# EAGLE board HSI-interface-1 (EAGLE 7.6.0)
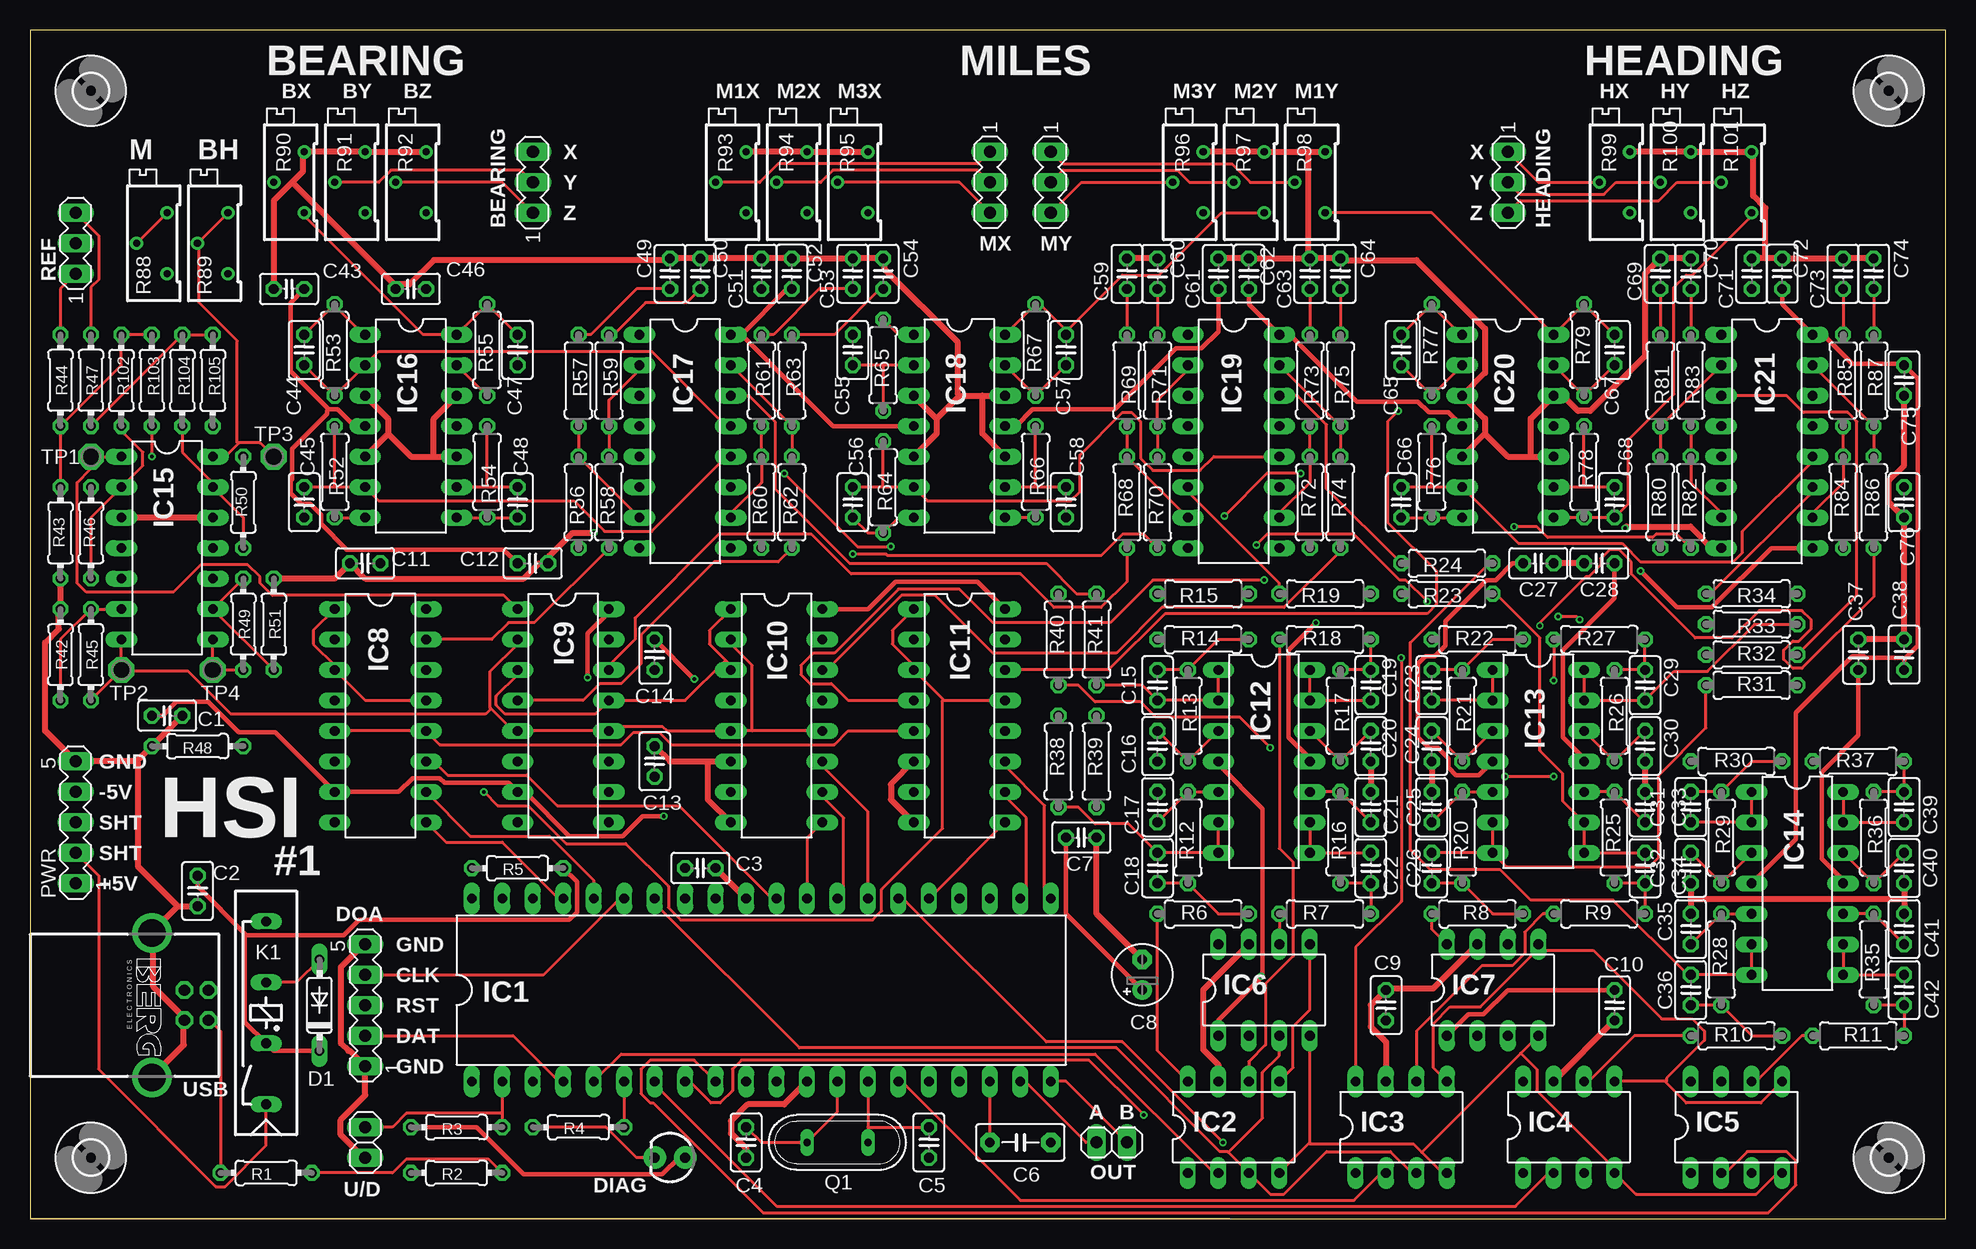
[diagram p3: board, top side]
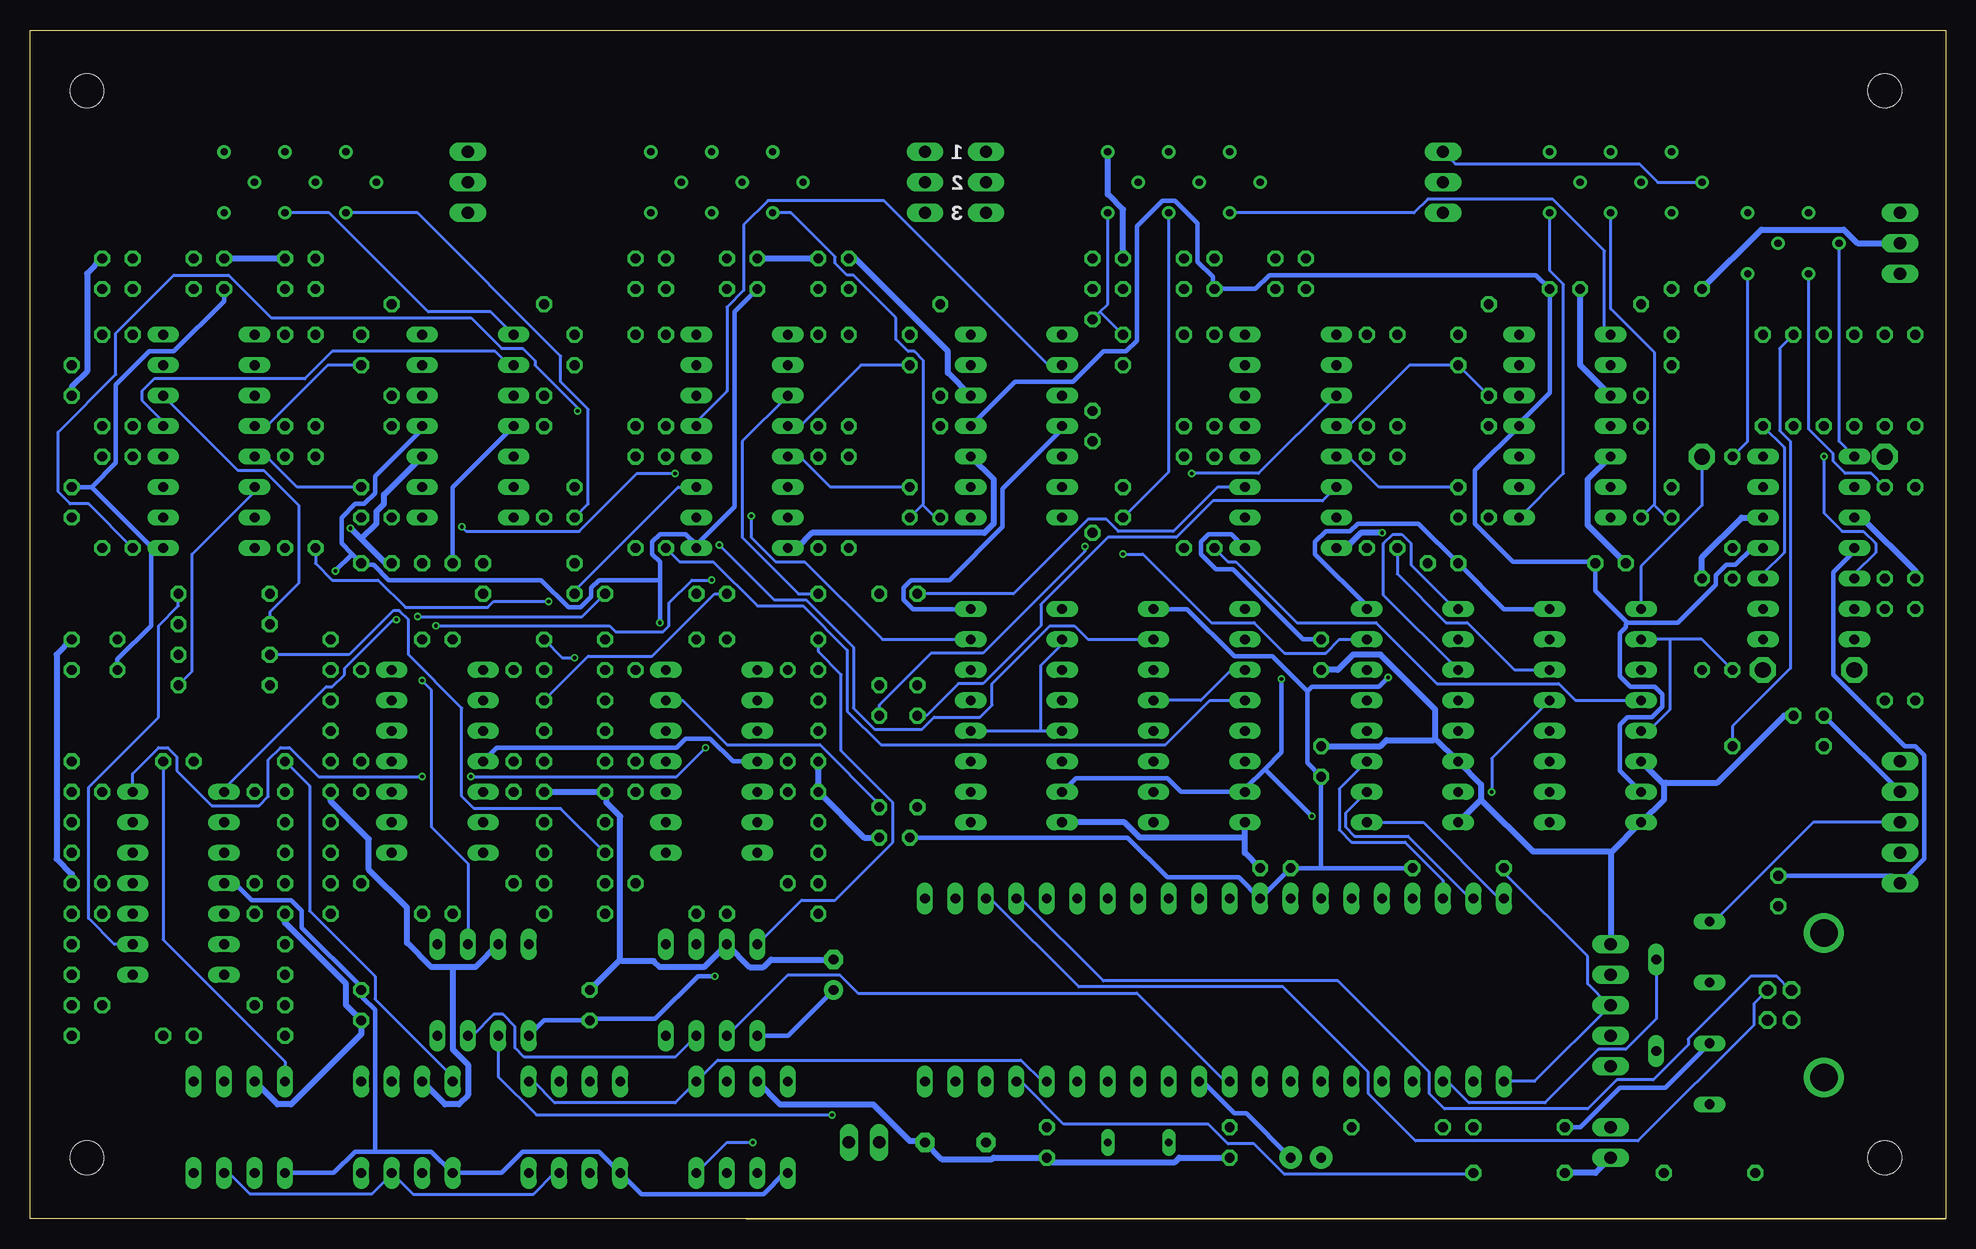
[diagram p4: board, bottom side, seen from below]

Size 159.69 x 99.06 mm. Coordinates in mm from the lower left corner, seen from the top.
Outline: 100,0 0,0
Outline: 0,0.01 159.69,0.01 159.69,99.06 0,99.06 0,0.01
Copper layers (1*16): Top 0.035mm / dielectric 1.5mm / Bottom 0.035mm
Design rules "ITEADstudio_DRC": minimum track width 6mil, minimum drill 12mil, track to track 6mil, track to pad 6mil, pad to pad 6mil, via to via 6mil, smd to smd 0mil, copper to edge 10mil, drill to drill 10mil, minimum pad ring 10mil, minimum via ring 6mil, stop-mask expansion 2mil, vias tented up to drill 100mil, thermal gap 10mil
Net classes: 0 default: width 0.254 mm, drill 0.254 mm, clearance 0.254 mm; 1 ground: width 0.508 mm, drill 0.254 mm, clearance 0.254 mm; 2 +5V: width 0.381 mm, drill 0.254 mm, clearance 0.254 mm; 3 -5V: width 0.381 mm, drill 0.254 mm, clearance 0.254 mm; 4 +12V: width 0.381 mm, drill 0.254 mm, clearance 0.254 mm; 5 -12V: width 0.381 mm, drill 0.254 mm, clearance 0.254 mm; 6 HIV1: width 0.381 mm, drill 0.381 mm, clearance 0.508 mm; 7 HIV2: width 0.381 mm, drill 0.381 mm, clearance 0.508 mm

## Footprints (pad centres in the part's own frame; a part is rotated, then mirrored left to right if it is on the bottom)
MA03-1 = drill 1.016 long: 1 -2.54,0; 2 0,0; 3 2.54,0
C025-025X050 = drill 0.813 octagon: 1 -1.27,0; 2 1.27,0
C5B3 = drill 0.813 pad 1.6 octagon: 1 -2.54,0; 2 2.54,0
E2,5-5 = drill 0.813 pad 1.6: + -1.27,0 | drill 0.813 pad 1.6 octagon: - 1.27,0
DO35-7 = drill 0.813 long: A 3.81,0; C -3.81,0
LED3MM = drill 0.813 pad 1.88: A -1.27,0; K 1.27,0
MA05-1 = drill 1.016 long: 1 -5.08,0; 2 -2.54,0; 3 0,0; 4 2.54,0; 5 5.08,0
2,8 = hole 2.8: 0,0
DIL40 = drill 0.813 long: 1 -24.13,-7.62; 2 -21.59,-7.62; 3 -19.05,-7.62; 4 -16.51,-7.62; 5 -13.97,-7.62; 6 -11.43,-7.62; 7 -8.89,-7.62; 8 -6.35,-7.62; 9 -3.81,-7.62; 10 -1.27,-7.62; 11 1.27,-7.62; 12 3.81,-7.62; 13 6.35,-7.62; 14 8.89,-7.62; 15 11.43,-7.62; 16 13.97,-7.62; 17 16.51,-7.62; 18 19.05,-7.62; 19 21.59,-7.62; 20 24.13,-7.62; 21 24.13,7.62; 22 21.59,7.62; 23 19.05,7.62; 24 16.51,7.62; 25 13.97,7.62; 26 11.43,7.62; 27 8.89,7.62; 28 6.35,7.62; 29 3.81,7.62; 30 1.27,7.62; 31 -1.27,7.62; 32 -3.81,7.62; 33 -6.35,7.62; 34 -8.89,7.62; 35 -11.43,7.62; 36 -13.97,7.62; 37 -16.51,7.62; 38 -19.05,7.62; 39 -21.59,7.62; 40 -24.13,7.62
DIL08 = drill 0.813 long: 1 -3.81,-3.81; 2 -1.27,-3.81; 3 1.27,-3.81; 4 3.81,-3.81; 5 3.81,3.81; 6 1.27,3.81; 7 -1.27,3.81; 8 -3.81,3.81
DIL16 = drill 0.813 long: 1 -8.89,-3.81; 2 -6.35,-3.81; 3 -3.81,-3.81; 4 -1.27,-3.81; 5 1.27,-3.81; 6 3.81,-3.81; 7 6.35,-3.81; 8 8.89,-3.81; 9 8.89,3.81; 10 6.35,3.81; 11 3.81,3.81; 12 1.27,3.81; 13 -1.27,3.81; 14 -3.81,3.81; 15 -6.35,3.81; 16 -8.89,3.81
DIL14 = drill 0.813 long: 1 -7.62,-3.81; 2 -5.08,-3.81; 3 -2.54,-3.81; 4 0,-3.81; 5 2.54,-3.81; 6 5.08,-3.81; 7 7.62,-3.81; 8 7.62,3.81; 9 5.08,3.81; 10 2.54,3.81; 11 0,3.81; 12 -2.54,3.81; 13 -5.08,3.81; 14 -7.62,3.81
REED = drill 0.813 long: 1 -17.78,2.54; 3 -12.7,2.54; 5 -7.62,2.54; 7 -2.54,2.54
1X02 = drill 1.016 long: 1 -1.27,0; 2 1.27,0
QS = drill 0.61 long: 1 -2.54,0; 2 2.54,0
0204/7 = drill 0.813 octagon: 1 -3.81,0; 2 3.81,0
0207/7 = drill 0.813 octagon: 1 -3.81,0; 2 3.81,0
RTRIM64Z = drill 0.61: 1 0,-2.54; 2 -2.54,0; 3 0,2.54
P1-13 = drill 1.321 pad 2.159 octagon: TP 0,0
PN61729-S = drill 0.95 octagon: 1 1.25,4.71; 2 -1.25,4.71; 3 -1.25,2.71; 4 1.25,2.71 | drill 2.3 pad 2.9: S1 -6.02,0; S2 6.02,0

## Placement (x,y rotation side)
BEARING  BEARING  [MA03-1]  41.91,86.37 90 top
C1  100n  [C025-025X050]  11.43,41.92 180 top
C2  100n  [C025-025X050]  13.97,27.32 90 top
C3  100n  [C025-025X050]  55.88,29.22 180 top
C4  18p  [C025-025X050]  59.69,6.36 90 top
C5  18p  [C025-025X050]  74.93,6.36 90 top
C6  220n  [C5B3]  82.55,6.36 0 top
C7  100n  [C025-025X050]  87.63,31.76 180 top
C8  4µ7  [E2,5-5]  92.71,20.33 90 top
C9  100n  [C025-025X050]  113.03,17.79 270 top
C10  100n  [C025-025X050]  132.08,17.79 90 top
C11  100n  [C025-025X050]  27.94,54.62 180 top
C12  100n  [C025-025X050]  41.91,54.62 180 top
C13  100n  [C025-025X050]  52.07,38.11 270 top
C14  100n  [C025-025X050]  52.07,47 270 top
C15  1µF  [C025-025X050]  93.98,44.46 270 top
C16  1µF  [C025-025X050]  93.98,39.38 270 top
C17  1µF  [C025-025X050]  93.98,34.3 90 top
C18  1µF  [C025-025X050]  93.98,29.22 90 top
C19  1µF  [C025-025X050]  111.76,44.46 270 top
C20  1µF  [C025-025X050]  111.76,39.38 270 top
C21  1µF  [C025-025X050]  111.76,34.3 90 top
C22  1µF  [C025-025X050]  111.76,29.22 90 top
C23  1µF  [C025-025X050]  116.84,44.46 270 top
C24  1µF  [C025-025X050]  116.84,39.38 270 top
C25  1µF  [C025-025X050]  116.84,34.3 90 top
C26  1µF  [C025-025X050]  116.84,29.22 90 top
C27  100n  [C025-025X050]  125.73,54.62 180 top
C28  100n  [C025-025X050]  130.81,54.62 180 top
C29  1µF  [C025-025X050]  134.62,44.46 270 top
C30  1µF  [C025-025X050]  134.62,39.38 270 top
C31  1µF  [C025-025X050]  134.62,34.3 90 top
C32  1µF  [C025-025X050]  134.62,29.22 90 top
C33  1µF  [C025-025X050]  138.43,34.3 270 top
C34  1µF  [C025-025X050]  138.43,29.22 270 top
C35  1µF  [C025-025X050]  138.43,24.14 90 top
C36  1µF  [C025-025X050]  138.43,19.06 90 top
C37  100n  [C025-025X050]  152.4,47 90 top
C38  100n  [C025-025X050]  156.21,47 270 top
C39  1µF  [C025-025X050]  156.21,34.3 270 top
C40  1µF  [C025-025X050]  156.21,29.22 270 top
C41  1µF  [C025-025X050]  156.21,24.14 90 top
C42  1µF  [C025-025X050]  156.21,19.06 90 top
C43  100n  [C025-025X050]  21.59,77.48 0 top
C44  470p  [C025-025X050]  22.86,72.4 90 top
C45  470p  [C025-025X050]  22.86,59.7 270 top
C46  100n  [C025-025X050]  31.75,77.48 180 top
C47  470p  [C025-025X050]  40.64,72.4 90 top
C48  470p  [C025-025X050]  40.64,59.7 270 top
C49  560p  [C025-025X050]  53.34,78.75 90 top
C50  560p  [C025-025X050]  55.88,78.75 90 top
C51  100n  [C025-025X050]  60.96,78.75 90 top
C52  100n  [C025-025X050]  63.5,78.75 270 top
C53  560p  [C025-025X050]  68.58,78.75 90 top
C54  560p  [C025-025X050]  71.12,78.75 90 top
C55  470p  [C025-025X050]  68.58,72.4 90 top
C56  470p  [C025-025X050]  68.58,59.7 270 top
C57  470p  [C025-025X050]  86.36,72.4 90 top
C58  470p  [C025-025X050]  86.36,59.7 270 top
C59  560p  [C025-025X050]  91.44,78.75 90 top
C60  560p  [C025-025X050]  93.98,78.75 90 top
C61  100n  [C025-025X050]  99.06,78.75 90 top
C62  100n  [C025-025X050]  101.6,78.75 270 top
C63  560p  [C025-025X050]  106.68,78.75 90 top
C64  560p  [C025-025X050]  109.22,78.75 90 top
C65  470p  [C025-025X050]  114.3,72.4 90 top
C66  470p  [C025-025X050]  114.3,59.7 270 top
C67  470p  [C025-025X050]  132.08,72.4 90 top
C68  470p  [C025-025X050]  132.08,59.7 270 top
C69  560p  [C025-025X050]  135.89,78.75 90 top
C70  560p  [C025-025X050]  138.43,78.75 90 top
C71  100n  [C025-025X050]  143.51,78.75 90 top
C72  100n  [C025-025X050]  146.05,78.75 270 top
C73  560p  [C025-025X050]  151.13,78.75 90 top
C74  560p  [C025-025X050]  153.67,78.75 90 top
C75  100n  [C025-025X050]  156.21,69.86 90 top
C76  100n  [C025-025X050]  156.21,59.7 270 top
D1  1N4148DO35-7  [DO35-7]  24.13,17.79 90 top
DIAG  LED  [LED3MM]  53.34,5.09 180 top
DOA  DOA  [MA05-1]  27.94,17.79 90 top
H1  MOUNT-HOLE2.8  [2,8]  154.94,5.09 0 top
H2  MOUNT-HOLE2.8  [2,8]  5.08,5.09 0 top
H3  MOUNT-HOLE2.8  [2,8]  154.94,93.99 0 top
H4  MOUNT-HOLE2.8  [2,8]  5.08,93.99 0 top
HEADING  HEADING  [MA03-1]  123.19,86.37 270 top
IC1  PIC18F4550_40  [DIL40]  60.96,19.06 0 top
IC2  MCP4822-E/P  [DIL08]  100.33,7.63 0 top
IC3  MCP4822-E/P  [DIL08]  114.3,7.63 0 top
IC4  MCP4822-E/P  [DIL08]  128.27,7.63 0 top
IC5  MCP4822-E/P  [DIL08]  142.24,7.63 0 top
IC6  MCP4822-E/P  [DIL08]  102.87,19.06 0 top
IC7  MCP4822-E/P  [DIL08]  121.92,19.06 0 top
IC8  4053N  [DIL16]  29.21,41.92 270 top
IC9  4053N  [DIL16]  44.45,41.92 270 top
IC10  4053N  [DIL16]  62.23,41.92 270 top
IC11  4053N  [DIL16]  77.47,41.92 270 top
IC12  TL084P  [DIL14]  102.87,38.11 270 top
IC13  TL084P  [DIL14]  125.73,38.11 270 top
IC14  TL084P  [DIL14]  147.32,27.95 270 top
IC15  TL084P  [DIL14]  11.43,55.89 270 top
IC16  TL084P  [DIL14]  31.75,66.05 270 top
IC17  SSM2164P  [DIL16]  54.61,64.78 270 top
IC18  TL084P  [DIL14]  77.47,66.05 270 top
IC19  SSM2164P  [DIL16]  100.33,64.78 270 top
IC20  TL084P  [DIL14]  123.19,66.05 270 top
IC21  SSM2164P  [DIL16]  144.78,64.78 270 top
K1  REED  [REED]  22.23,27.32 90 top
MX  MX  [MA03-1]  80.01,86.37 270 top
MY  MY  [MA03-1]  85.09,86.37 270 top
OUT  OUT  [1X02]  90.17,6.36 180 top
PWR  PWR  [MA05-1]  3.81,33.03 90 top
Q1  20MHz  [QS]  67.31,6.36 180 top
R1  1k  [0204/7]  19.68,3.82 0 top
R2  100k  [0204/7]  35.56,3.82 0 top
R3  10k  [0204/7]  35.56,7.63 180 top
R4  470  [0204/7]  45.72,7.63 0 top
R5  10k  [0204/7]  40.64,29.22 0 top
R6  150k  [0207/7]  97.79,25.41 0 top
R7  150k  [0207/7]  107.95,25.41 0 top
R8  150k  [0207/7]  120.65,25.41 0 top
R9  150k  [0207/7]  130.81,25.41 0 top
R10  150k  [0207/7]  142.24,15.25 0 top
R11  150k  [0207/7]  152.4,15.25 0 top
R12  150k  [0207/7]  96.52,31.76 90 top
R13  150k  [0207/7]  96.52,41.92 270 top
R14  150k  [0207/7]  97.79,48.27 0 top
R15  2k7  [0207/7]  97.79,52.08 180 top
R16  150k  [0207/7]  109.22,31.76 90 top
R17  150k  [0207/7]  109.22,41.92 270 top
R18  150k  [0207/7]  107.95,48.27 0 top
R19  2k7  [0207/7]  107.95,52.08 180 top
R20  150k  [0207/7]  119.38,31.76 90 top
R21  150k  [0207/7]  119.38,41.92 270 top
R22  150k  [0207/7]  120.65,48.27 0 top
R23  2k7  [0207/7]  118.11,52.08 180 top
R24  2k7  [0207/7]  118.11,54.62 180 top
R25  150k  [0207/7]  132.08,31.76 90 top
R26  150k  [0207/7]  132.08,41.92 270 top
R27  150k  [0207/7]  130.81,48.27 0 top
R28  150k  [0207/7]  140.97,21.6 90 top
R29  150k  [0207/7]  140.97,31.76 270 top
R30  150k  [0207/7]  142.24,38.11 0 top
R31  2k7  [0207/7]  143.51,44.46 0 top
R32  2k7  [0207/7]  143.51,47 0 top
R33  2k7  [0207/7]  143.51,49.54 180 top
R34  2k7  [0207/7]  143.51,52.08 180 top
R35  150k  [0207/7]  153.67,21.6 90 top
R36  150k  [0207/7]  153.67,31.76 270 top
R37  150k  [0207/7]  152.4,38.11 0 top
R38  2k7  [0207/7]  85.72,38.11 90 top
R39  2k7  [0207/7]  88.9,38.11 90 top
R40  2k7  [0207/7]  85.72,48.27 90 top
R41  2k7  [0207/7]  88.9,48.27 90 top
R42  1k  [0204/7]  2.54,47 90 top
R43  1k  [0204/7]  2.54,57.16 270 top
R44  120k  [0204/7]  2.54,69.86 90 top
R45  1k2  [0204/7]  5.08,47 90 top
R46  560  [0204/7]  5.08,57.16 270 top
R47  120k  [0204/7]  5.08,69.86 90 top
R48  1k  [0204/7]  13.97,39.38 180 top
R49  1k2  [0204/7]  17.78,49.54 90 top
R50  560  [0204/7]  17.78,59.7 270 top
R51  1k  [0204/7]  20.32,49.54 90 top
R52  47k  [0207/7]  25.4,62.24 270 top
R53  47k  [0207/7]  25.4,72.4 90 top
R54  47k  [0207/7]  38.1,62.24 270 top
R55  47k  [0207/7]  38.1,72.4 90 top
R56  47k  [0207/7]  45.72,59.7 90 top
R57  560  [0207/7]  45.72,69.86 270 top
R58  47k  [0207/7]  48.26,59.7 90 top
R59  560  [0207/7]  48.26,69.86 270 top
R60  47k  [0207/7]  60.96,59.7 90 top
R61  560  [0207/7]  60.96,69.86 270 top
R62  47k  [0207/7]  63.5,59.7 90 top
R63  560  [0207/7]  63.5,69.86 270 top
R64  47k  [0207/7]  71.12,60.97 270 top
R65  47k  [0207/7]  71.12,71.13 90 top
R66  47k  [0207/7]  83.82,62.24 270 top
R67  47k  [0207/7]  83.82,72.4 90 top
R68  47k  [0207/7]  91.44,59.7 90 top
R69  560  [0207/7]  91.44,69.86 270 top
R70  47k  [0207/7]  93.98,59.7 90 top
R71  560  [0207/7]  93.98,69.86 270 top
R72  47k  [0207/7]  106.68,59.7 90 top
R73  560  [0207/7]  106.68,69.86 270 top
R74  47k  [0207/7]  109.22,59.7 90 top
R75  560  [0207/7]  109.22,69.86 270 top
R76  47k  [0207/7]  116.84,62.24 270 top
R77  47k  [0207/7]  116.84,72.4 90 top
R78  47k  [0207/7]  129.54,62.24 270 top
R79  47k  [0207/7]  129.54,72.4 90 top
R80  47k  [0207/7]  135.89,59.7 90 top
R81  560  [0207/7]  135.89,69.86 270 top
R82  47k  [0207/7]  138.43,59.7 90 top
R83  560  [0207/7]  138.43,69.86 270 top
R84  47k  [0207/7]  151.13,59.7 90 top
R85  560  [0207/7]  151.13,69.86 270 top
R86  47k  [0207/7]  153.67,59.7 90 top
R87  560  [0207/7]  153.67,69.86 270 top
R88  2k  [RTRIM64Z]  11.43,81.29 0 top
R89  2k  [RTRIM64Z]  16.51,81.29 0 top
R90  20k  [RTRIM64Z]  22.86,86.37 0 top
R91  20k  [RTRIM64Z]  27.94,86.37 0 top
R92  20k  [RTRIM64Z]  33.02,86.37 0 top
R93  20k  [RTRIM64Z]  59.69,86.37 0 top
R94  20k  [RTRIM64Z]  64.77,86.37 0 top
R95  20k  [RTRIM64Z]  69.85,86.37 0 top
R96  20k  [RTRIM64Z]  97.79,86.37 0 top
R97  20k  [RTRIM64Z]  102.87,86.37 0 top
R98  20k  [RTRIM64Z]  107.95,86.37 0 top
R99  20k  [RTRIM64Z]  133.35,86.37 0 top
R100  20k  [RTRIM64Z]  138.43,86.37 0 top
R101  20k  [RTRIM64Z]  143.51,86.37 0 top
R102  1k  [0204/7]  7.62,69.86 270 top
R103  1k  [0204/7]  10.16,69.86 270 top
R104  1k  [0204/7]  12.7,69.86 270 top
R105  1k  [0204/7]  15.24,69.86 270 top
REF  REF  [MA03-1]  3.81,81.29 90 top
TP1  PTR1PAD1-13  [P1-13]  5.08,63.51 0 top
TP2  PTR1PAD1-13  [P1-13]  7.62,45.73 0 top
TP3  PTR1PAD1-13  [P1-13]  20.32,63.51 0 top
TP4  PTR1PAD1-13  [P1-13]  15.24,45.73 0 top
U/D  U/D  [1X02]  27.94,6.36 90 top
USB  PN61729-S  [PN61729-S]  10.16,17.79 270 top

## Tracks (layer width: path | path; a pad name or v marks a point on that pad's centre or on a via)
+5V  (via drill 0.3)
  Top 0.381: C72.2 146.05,76.21 IC21.16 148.72,73.54 149.61,73.54 151.89,71.26 156.08,71.26 C75.2 157.35,69.99 157.35,47.76 156.21,46.62 | 156.21,46.62 C38.2 | C10.2 123.19,19.06 121.16,17.03 119.89,17.03 IC7.1 | IC14.4 147.19,31.63 147.19,42.17 151.89,46.87 152.91,46.87 153.03,46.75 156.08,46.75 156.21,46.62 | D1.C 20.32,13.98 K1.3 17.91,16.39 17.91,23.76 | DIAG.A 54.1,5.09 52.7,3.69 41.15,3.69 37.21,7.63 R3.2 | C2.2 13.97,27.7 17.91,23.76 | C62.2 101.6,76.21 IC19.16 104.27,73.54 105.16,73.54 110.62,68.08 115.7,68.08 116.59,67.19 118.24,67.19 IC20.4 | C7.2 86.36,25.41 C8.+ | IC12.4 99.06,37.86 102.74,34.17 102.74,20.2 | 102.74,20.2 99.06,16.52 IC6.1 | C27.2 123.57,54.62 122.17,53.22 121.41,53.22 117.98,49.79 117.98,47.76 117.09,46.87 116.33,46.87 115.7,46.24 115.7,40.14 116.59,39.25 117.35,39.25 118.24,38.36 118.24,37.6 118.87,36.97 120.78,36.97 IC13.4 | IC16.4 27.05,66.05 25.65,67.45 24.89,67.45 | 24.89,67.45 21.72,70.62 21.72,76.34 C43.2 | C12.2 39.5,55.76 26.42,55.76 24.26,57.92 24.26,58.68 23.37,59.57 22.61,59.57 21.72,60.46 21.72,61.48 21.84,61.6 21.84,64.15 24.77,67.07 24.77,67.32 24.89,67.45 | C52.2 63.12,77.48 59.31,73.67 IC17.16 59.44,73.54 66.93,66.05 IC18.4 | IC10.16 69.85,50.81 72.14,53.1 78.99,53.1 IC11.16 | IC9.16 48.26,50.56 46.48,48.78 v46.48,45.09 | R5.2 45.59,28.08 45.59,25.54 44.96,24.9 27.43,24.9 26.16,23.63 18.03,23.63 17.91,23.76 | v102.62,20.2 102.74,20.2
  Bottom 0.381: IC2.1 96.77,3.82 98.55,2.04 108.71,2.04 IC3.1 112.27,5.6 118.62,5.6 120.4,3.82 IC4.1 126.24,5.6 130.94,5.6 | IC5.1 134.37,3.82 132.59,5.6 130.94,5.6 | IC7.1 116.84,16.52 C9.2 112.9,16.65 107.57,16.65 104.01,20.2 v102.62,20.2 | IC14.4 142.62,27.95 141.22,26.55 137.92,26.55 137.03,25.66 137.03,24.27 132.08,19.31 C10.2 131.95,18.93 131.95,18.43 130.94,17.41 130.94,5.6 | C2.2 4.45,28.59 PWR.1 1.78,29.98 1.78,38.62 2.54,39.38 3.43,39.38 9.4,45.35 9.4,53.86 7.62,55.64 IC15.4 | IC1.11 61.98,11.44 59.31,8.77 58.29,8.77 DIAG.A | R3.2 30.48,7.63 27.18,10.93 23.37,10.93 K1.3 | C27.2 124.46,60.97 IC20.4 | IC12.4 101.09,38.11 103,40.02 105.03,40.02 105.79,39.25 120.78,39.25 IC13.4 | IC6.1 96.52,15.25 C8.+ | IC8.16 36.83,50.81 C12.2 43.94,57.92 49.02,57.92 49.66,57.29 51.69,57.29 52.58,56.4 52.58,55.38 48.26,51.06 IC9.16 | 52.07,29.22 C3.2 IC1.32 58.93,28.46 64.9,28.46 68.2,31.76 C7.2 | 52.07,29.22 R5.2 | 52.07,29.22 C13.2 53.21,37.98 53.21,43.95 | IC10.16 63.25,50.81 59.31,46.87 56.13,46.87 53.21,43.95 | IC18.4 73.66,65.8 78.61,60.84 78.61,57.67 83.06,53.22 86.23,53.22 86.87,52.59 86.87,51.57 86.11,50.81 IC11.16 | v46.48,45.09 47.24,44.33 52.83,44.33 53.21,43.95
-5V  (via drill 0.3)
  Top 0.381: C14.1 v55.37,44.97 | C1.2 11.05,41.92 12.19,43.06 14.86,43.06 17.4,40.52 20.45,40.52 IC8.7 30.73,35.57 31.88,36.71 34.16,36.71 34.54,36.33 39.88,36.33 IC9.7 40.77,35.44 41.4,35.44 44.96,31.89 49.4,31.89 51.05,33.54 v52.83,33.54 | IC14.11 151.13,28.2 149.35,29.98 149.35,37.22 152.4,40.27 C37.1 | IC13.11 129.54,38.36 127.76,40.14 127.76,47.38 132.08,51.7 C28.1 | IC18.11 82.17,66.05 83.57,67.45 90.42,67.45 95.5,72.53 97.66,72.53 99.06,73.92 C61.1 | IC12.11 106.68,38.36 104.9,40.14 104.9,47.38 v107.19,49.67 | IC21.9 145.16,55.89 140.21,50.94 137.29,50.94 v134.24,53.98
  Bottom 0.381: IC15.11 16.13,55.89 17.53,54.49 18.29,54.49 19.18,53.6 19.18,52.84 22.35,49.67 26.54,49.67 | 26.54,49.67 29.21,52.33 C11.1 29.34,54.75 36.07,54.75 39.24,57.92 39.24,62.37 IC16.11 35.56,66.3 33.02,68.84 C46.1 34.16,78.62 56.39,78.62 57.53,77.48 C51.1 61.09,77.61 61.09,78.5 62.36,79.77 62.36,82.94 64.26,84.85 65.28,84.85 67.44,82.69 67.44,73.16 68.33,72.27 70.23,72.27 72.77,69.73 77.6,69.73 IC18.11 | IC11.7 72.52,36.71 64.9,36.71 63.75,35.57 IC10.7 58.29,35.7 58.29,35.95 56.77,37.48 | C14.1 53.59,48.27 59.44,54.11 60.83,54.11 62.1,55.38 62.1,56.4 61.47,57.03 59.56,57.03 IC17.9 | 56.77,37.48 55.37,38.87 v55.37,44.97 | PWR.4 C1.2 | v52.83,33.54 56.77,37.48 | IC8.7 27.18,37.35 27.18,41.16 26.54,41.79 24.51,41.79 23.62,42.68 23.62,43.7 24.26,44.33 26.29,44.33 27.18,45.22 27.18,48.78 26.67,49.29 26.67,49.54 26.54,49.67 | 154.56,60.97 149.48,55.89 IC21.9 149.61,55.76 149.61,49.41 152.4,46.62 C37.1 | C76.1 154.56,60.97 | C71.1 143.51,76.46 147.7,72.27 149.73,72.27 152.53,69.48 152.53,63 154.56,60.97 | IC20.11 127,65.8 130.94,61.86 130.94,60.46 131.83,59.57 132.59,59.57 133.73,58.43 133.73,56.27 132.84,55.38 | 132.84,55.38 C28.1 131.95,54.49 131.06,54.49 129.79,53.22 117.09,53.22 114.81,50.94 113.79,50.94 112.9,51.83 112.9,52.59 112.27,53.22 107.19,53.22 | C61.1 100.97,75.58 100.97,59.32 104.14,56.14 IC19.9 104.27,56.27 105.03,57.03 107.19,57.03 107.82,56.4 107.82,55.38 107.19,54.75 107.19,53.22 | 107.19,53.22 v107.19,49.67 | 132.84,55.38 v134.24,53.98
BRB3
  Top 0.254: IC1.36 46.99,28.2 43.31,31.89 36.7,31.89 IC8.10
BRB4
  Top 0.254: IC1.37 44.07,26.68 39.37,31.38 34.67,31.38 IC8.9
BRD7
  Top 0.254: IC1.30 61.85,26.68 54.1,34.43 43.94,34.43 41.4,36.97 34.8,36.97 33.66,38.11 IC8.11
BRG_I  (via drill 0.3)
  Top 0.254: IC11.1 71.88,49.03 71.88,47.89 73.66,46.11 IC11.3 76.14,43.25 | IC11.13 76.2,43.19 76.14,43.25 | IC8.1 23.62,49.03 23.62,47.89 25.4,46.11 IC8.3 27.94,43.19 IC8.13 | R89.3 R89.2 14.1,81.29 14.1,76.34 17.27,73.16 17.27,64.65 17.34,64.59 | IC15.14 16.26,63.51 17.34,64.59 | 17.34,64.59 17.4,64.65 19.18,64.65 TP3.TP | v37.85,35.57 38.99,34.43 41.53,34.43 44.7,31.25 49.66,31.25 53.21,27.7 53.21,25.92 54.23,24.9 70.23,24.9 70.99,25.66 70.99,27.44 76.07,32.52 76.07,43.19 76.14,43.25
  Bottom 0.254: IC8.1 25.4,54.37 20.32,59.45 TP3.TP | v37.85,35.57 37.85,38.36 IC8.13
BRG_N
  Top 0.254: IC8.5 IC8.12 34.16,39.51 49.28,39.51 50.29,40.52 52.45,40.52 53.47,39.51 67.06,39.51 68.2,40.65 IC11.5 | R49.1 TP4.TP IC15.8
  Bottom 0.254: IC11.12 75.44,40.65 | 75.44,40.65 IC11.5 | IC11.2 73.66,47.89 75.44,46.11 75.44,40.65 | 22.99,48.27 20.32,48.27 R49.1 | 22.99,48.27 IC8.2 | IC8.5 24.77,40.65 22.99,42.43 22.99,48.27
BXC
  Top 0.254: IC2.6 101.6,13.09 103,14.49 103,19.57 105.28,21.85 105.28,29.73 104.14,30.87 R18.1
BXCF
  Top 0.254: IC12.14 IC12.13 C19.2
  Bottom 0.254: R39.1 88.9,34.55 93.85,39.51 101.6,39.51 105.28,43.19 IC12.13
BXV
  Top 0.254: IC8.15 38.48,48.27 39.88,49.67 42.04,49.67 R58.1
BYC
  Bottom 0.254: IC5.8 138.43,13.09 148.59,23.25 R37.1
BYCF  (via drill 0.3)
  Top 0.254: IC14.14 IC14.13 C39.2 | R40.1 87.38,44.46 88.77,43.06 92.58,43.06 93.85,41.79 100.84,41.79 v103.38,39.25 | v127,36.84 v122.94,36.84
  Bottom 0.254: v103.38,39.25 105.79,36.84 v122.94,36.84 | v127,36.84 135.64,36.84 138.05,39.25 138.81,39.25 139.83,38.24 139.83,35.19 140.59,34.43 144.53,34.43 147.45,37.35 147.45,38.49 148.21,39.25 148.97,39.25 151.13,37.09 IC14.14
BYV
  Bottom 0.254: IC8.4 30.86,43.19 32.26,44.59 42.42,44.59 47.5,49.67 54.1,49.67 59.18,54.75 59.82,54.75 R60.1
BZC
  Top 0.254: R6.1 93.98,13.98 IC2.8
BZCF
  Top 0.254: IC12.6 IC12.7 C18.2 91.57,32.9 88.77,32.9 87.38,34.3 R38.1
BZV
  Bottom 0.254: IC8.14 35.94,45.73 39.88,49.67 41.66,49.67 45.72,53.73 R56.1
CRC6
  Top 0.254: IC11.9 IC1.25
CRD2
  Top 0.254: IC11.11 81.28,37.73 84.58,34.43 84.58,27.19 IC1.21
CRD3
  Top 0.254: IC11.10 81.28,35.19 83.06,33.41 83.06,27.19 IC1.22
CS2
  Top 0.254: IC2.2 98.68,3.82 88.77,13.73 49.28,13.73 IC1.5
CS3
  Top 0.254: IC3.2 112.65,3.82 110.36,1.53 82.55,1.53 72.64,11.44 IC1.15
CS4
  Top 0.254: IC4.2 126.62,3.82 123.83,1.03 62.23,1.03 52.07,11.19 IC1.7
CS5
  Bottom 0.254: IC1.10 60.07,11.44 67.44,18.81 90.68,18.81 92.2,20.33 96.52,20.33 IC6.2
CS6  (via drill 0.3)
  Top 0.254: IC1.8 54.99,11.44 56.77,9.66 57.53,9.66 58.55,10.68 58.55,12.46 59.31,13.22 88.27,13.22 v92.84,8.65
  Bottom 0.254: v92.84,8.65 117.47,8.65 120.65,11.82 IC7.2
CS7
  Top 0.254: IC5.2 141.35,3.82 143.13,5.6 146.43,5.6 147.19,4.84 147.19,2.8 144.91,0.52 61.09,0.52 51.94,9.66 51.69,9.66 50.93,10.42 50.93,12.46 51.69,13.22 55.37,13.22 IC1.9
CXC
  Top 0.254: IC5.6 143.89,11.44 147.7,15.25 R11.1
CXCF
  Top 0.254: IC14.9 IC14.8 C42.2
  Bottom 0.254: R34.1 147.32,51.06 148.97,49.41 148.97,41.79 154.81,35.95 154.81,25.03 152.65,22.87 IC14.9
CXV  (via drill 0.3)
  Top 0.254: IC11.14 89.92,45.73 94.61,50.43 116.46,50.43 117.22,51.19 117.22,53.98 113.16,58.05 113.16,66.43 v114.05,67.32
  Bottom 0.254: v114.05,67.32 114.05,67.57 117.6,71.13 117.6,71.51 118.62,72.53 120.4,72.53 122.94,75.07 139.57,75.07 143.13,78.62 147.7,78.62 152.53,73.8 152.53,70.37 157.35,65.54 157.35,60.59 156.34,59.57 154.81,59.57 R84.1
CYC  (via drill 0.3)
  Top 0.254: R27.1 v127,44.84
  Bottom 0.254: IC7.6 123.19,29.6 126.24,32.65 126.24,44.08 v127,44.84
CYCF
  Top 0.254: IC13.14 IC13.13 C29.2 137.03,45.6 139.83,45.6 143.76,49.54 R33.1
CYV  (via drill 0.3)
  Top 0.254: IC11.4 68.2,43.19 66.8,44.59 65.02,44.59 64.26,45.35 64.26,46.11 65.28,47.13 67.06,47.13 72.39,52.46 77.47,52.46 80.26,49.67 90.04,49.67 93.6,53.22 v102.87,53.22 | v125.86,49.41 125.86,49.67 129.67,53.48 129.92,53.48 130.94,54.49 130.94,55 131.7,55.76 132.46,55.76 133.48,54.75 133.48,53.73 138.81,48.4 141.86,48.4 144.15,50.68 147.7,50.68 148.46,49.92 148.46,49.16 147.45,48.14 146.94,48.14 146.18,47.38 146.18,46.62 146.94,45.86 147.7,45.86 153.67,51.83 R86.1
  Bottom 0.254: v102.87,53.22 104.52,53.22 106.43,51.32 106.43,49.41 106.93,48.91 110.87,48.91 111.38,49.41 v125.86,49.41
CZC
  Top 0.254: R8.1 116.84,24.14 IC7.8
CZCF
  Top 0.254: IC13.7 C26.2 | IC13.7 IC13.6 | R31.1 139.7,40.9 135.76,36.97 135.76,30.11 135,29.35 123.06,29.35 IC13.7
CZV  (via drill 0.3)
  Top 0.254: v99.57,58.56 103.12,62.11 v105.92,62.11 | v123.7,57.67 125.6,57.67 126.49,56.78 135.25,56.78 135.51,57.03 137.29,57.03 R82.1
  Bottom 0.254: IC11.15 88.65,48.27 95.12,54.75 97.54,54.75 99.57,56.78 v99.57,58.56 | v105.92,62.11 109.09,62.11 113.92,57.29 123.32,57.29 v123.7,57.67
DIAG
  Top 0.254: IC1.6 R4.2
DOA_CLK
  Top 0.254: IC1.35 49.15,26.68 42.8,20.33 DOA.4
DOA_DAT
  Top 0.254: IC1.4 44.07,11.44 40.26,15.25 DOA.2
GND  (via drill 0.3)
  Top 0.508: R92.3 R91.3 R90.3 22.73,88.78 22.73,87.26 21.84,86.37 | C43.1 20.32,84.85 21.84,86.37 | 29.84,65.42 IC16.5 | 29.84,65.42 29.84,66.69 IC16.3 | 33.66,63.51 31.75,63.51 29.84,65.42 | 33.66,63.51 IC16.10 | IC16.12 33.66,66.69 33.66,63.51 | R43.2 R42.2 2.41,50.68 2.41,49.16 1.27,48.02 1.27,40.65 PWR.5 8.89,38.11 | IC15.12 IC15.3 | R51.2 25.4,53.35 C11.2 27.94,53.35 41.15,53.35 42.42,54.62 C12.1 43.31,54.75 43.31,55.25 45.21,57.16 v46.99,57.16 | 21.84,86.37 30.48,77.73 C46.2 30.61,77.86 31.62,77.86 33.66,79.89 53.21,79.89 C49.2 C50.2 C51.2 C52.1 C53.2 C54.2 71.25,79.89 71.25,79.13 77.34,73.04 77.34,68.72 77.47,68.59 | C1.1 R48.2 8.89,38.11 | 12.32,26.05 C2.1 | 12.32,26.05 10.16,23.89 USB.S1 10.29,23.63 10.29,19.31 12.83,16.77 USB.4 12.83,16.52 12.83,14.49 10.16,11.82 USB.S2 | 12.32,26.05 9.02,29.35 9.02,37.98 8.89,38.11 | U/D.1 27.81,5.09 25.91,7 25.91,8.27 27.94,10.3 DOA.1 26.67,13.98 26.54,13.98 25.91,14.62 25.91,20.96 27.81,22.87 DOA.5 | 56.52,38.11 53.34,38.11 C13.1 | 56.52,38.11 IC10.6 | IC11.8 71.75,34.93 71.75,36.2 IC11.6 | C3.1 IC1.31 | 56.52,38.11 56.52,34.93 IC10.8 | C40.2 156.21,26.68 | 156.21,26.68 C41.2 | C34.2 138.43,26.68 | 138.43,26.68 C35.2 | C10.1 IC4.7 | 138.43,26.68 156.21,26.68 | C20.2 C21.2 | C24.2 C25.2 | C30.2 C31.2 | IC3.7 113.03,14.74 111.76,16.01 111.76,17.79 C9.1 113.16,19.19 116.97,19.19 IC7.7 | C4.1 59.69,5.85 58.42,7.12 58.42,8.14 59.82,9.54 62.87,9.54 IC1.12 | IC2.7 99.06,12.84 97.79,14.11 97.79,19.06 IC6.7 | C7.1 88.9,25.41 C8.- | 121.28,65.42 IC20.5 | 121.28,65.42 121.28,66.69 IC20.3 121.28,70.5 121.28,74.18 115.57,79.89 109.35,79.89 C64.2 C63.2 | 125.09,63.51 123.19,63.51 121.28,65.42
  Top 0.508: 125.09,63.51 IC20.10 | 125.09,63.51 125.09,66.69 IC20.12 127.13,68.46 127.89,68.46 129.03,67.32 130.05,67.32 134.62,71.89 134.62,78.75 C69.2 C70.2 | C28.2 C27.1 | IC21.8 140.21,55.89 138.43,57.67 133.1,57.67 v132.97,57.54 | C37.2 C38.1 C76.2 154.94,59.7 154.94,61.48 156.21,62.75 C75.1 | R99.3 R100.3 R101.3 143.64,88.78 143.64,85.23 144.65,84.21 144.65,80.02 | C74.2 C73.2 C72.1 144.65,80.02 | 144.65,80.02 C71.2 | R96.3 R97.3 106.55,88.91 | 106.55,88.91 R98.3 | C60.2 C59.2 | C61.2 C62.1 C63.2 | 106.55,88.91 106.55,80.15 C63.2 | R93.3 R94.3 R95.3 | IC18.5 75.56,65.42 75.56,66.69 | IC18.3 75.56,66.69 | 77.47,68.59 79.38,68.59 | 79.38,68.59 IC18.12 | 75.56,66.69 77.47,68.59 | 79.38,68.59 79.38,65.42 IC18.10
  Bottom 0.508: REF.2 7.37,81.29 8.51,82.43 15.37,82.43 C43.1 | C46.2 30.48,71.13 IC16.3 | R43.2 2.54,53.98 6.99,58.43 IC15.3 | IC17.8 50.04,55.89 48.77,57.16 v46.99,57.16 | IC15.12 17.02,58.43 20.32,55.13 R51.2 | IC16.5 29.84,61.6 29.84,57.79 C11.2 | R2.1 29.21,3.82 U/D.1 | 23.5,36.2 23.5,34.93 IC8.8 27.94,30.49 | IC8.6 23.5,36.2 | 27.94,30.49 DOA.5 | 38.73,34.93 IC9.8 | 38.73,34.93 38.73,36.2 IC9.6 42.55,40.02 | C14.2 50.67,45.73 49.4,47 47.12,47 42.55,42.43 42.55,40.02 | 58.42,31.76 58.42,30.49 C3.1 | 58.42,31.76 IC10.8 | IC11.8 68.45,33.03 67.18,31.76 58.42,31.76 | C13.1 47.12,39.38 46.61,39.89 42.67,39.89 42.55,40.02 | 38.73,34.93 34.42,30.62 28.07,30.62 27.94,30.49 | C1.1 13.46,41.92 19.05,36.33 23.37,36.33 23.5,36.2 | IC5.7 139.06,9.54 137.92,9.54 132.08,15.38 C10.1 133.35,17.79 133.35,19.57 138.43,24.65 C35.2 | C25.2 C21.2 111.63,35.44 111.63,34.68 110.49,33.54 110.49,21.6 | C31.2 134.62,34.81 131.44,31.63 131.44,29.09 128.27,25.92 128.27,23 126.24,20.96 124.46,20.96 | 124.46,20.96 122.56,20.96 IC7.7 | C9.1 110.49,21.6 | IC4.7 125.09,9.54 123.95,9.54 123.19,10.3 123.19,12.84 124.46,14.11 124.46,20.96 | C4.1 63.88,5.09 64.26,4.71 74.55,4.71 C5.1 79.38,5.09 79.5,4.96 83.69,4.96 C6.2 85.22,6.49 86.36,6.49 89.41,9.54 97.16,9.54 IC2.7 | C7.1 90.17,31.76 C17.2 C16.2 | C8.- 97.92,21.6 98.55,20.96 99.69,20.96 IC6.7 103.5,20.96 107.19,20.96 107.7,21.47 110.36,21.47 110.49,21.6 | 132.08,56.65 130.05,54.62 C28.2 | 132.08,56.65 v132.97,57.54 | IC20.10 130.18,60.34 130.18,59.57 130.81,58.94 130.81,57.92 132.08,56.65 | C71.2 C70.2 | C75.1 156.21,69.35 154.94,70.62 154.94,78.75 C74.2 | C61.2 C60.2
  Bottom 0.508: R95.3 69.85,85.35 68.58,84.08 C53.2 | IC19.8 95.76,55.89 94.49,57.16 80.14,57.16 79.38,57.92 79.38,61.6 IC18.10 | C59.2 90.93,80.02 83.19,72.27 83.19,70.5 IC18.12 | C40.2 156.21,28.71 157.48,29.98 157.48,47 C38.1
HIV1
  Top 0.254: R44.2 2.54,77.48 REF.1
HIV2
  Top 0.254: R47.2 5.08,77.61 5.71,78.24 5.71,81.93 REF.3
LDAC
  Top 0.254: IC4.5 136.27,11.44 136.33,11.38 | 136.33,11.38 138.05,9.66 144.27,9.66 IC5.5 | IC6.5 106.68,17.41 105.28,16.01 105.28,12.58 IC2.5 | IC3.5 116.97,12.58 116.97,16.27 118.36,17.66 120.9,17.66 125.73,22.49 IC7.5 125.73,22.36 130.3,22.36 136.02,16.65 138.56,16.65 139.57,15.63 139.57,14.87 136.4,11.69 136.4,11.44 136.33,11.38
  Bottom 0.254: IC1.16 75.31,11.44 77.09,13.22 102.36,13.22 IC2.5 105.92,9.66 115.95,9.66 117.73,11.44 IC3.5
M1XC
  Bottom 0.254: R14.1 93.98,47.25 92.08,45.35 92.08,39 87.76,34.68 87.76,31.38 92.58,26.55 95.38,26.55 IC6.8
M1XCF
  Top 0.254: R41.1 92.71,44.46 C15.2 IC12.2 IC12.1
M1XV
  Top 0.254: IC9.4 46.1,43.19 47.5,44.59 49.28,44.59 50.93,46.24 50.93,48.65 57.02,54.75 62.36,54.75 R62.1
M1YC
  Top 0.254: R7.1 IC6.6
M1YCF
  Top 0.254: IC12.9 IC12.8 C22.2
  Bottom 0.254: R32.1 133.1,47 129.41,50.68 128.91,50.68 128.14,49.92 128.14,47 123.7,42.55 123.7,35.19 122.68,34.17 115.44,34.17 C22.2
M1YV  (via drill 0.3)
  Top 0.254: v102.23,56.14 103.12,57.03 110.36,57.03 114.17,53.22 114.68,53.22 v116.46,51.45
  Bottom 0.254: IC10.15 71.5,48.27 72.64,49.41 74.68,49.41 79.5,44.59 79.5,42.81 80.52,41.79 84.33,41.79 85.34,40.78 89.28,40.78 91.06,42.55 91.06,47.63 95,51.57 97.66,51.57 v102.23,56.14 | v116.46,51.45 121.03,51.45 121.54,50.94 128.4,50.94 130.68,53.22 134.49,53.22 135.89,54.62 R80.1
M2XC
  Top 0.254: IC3.6 115.57,15.63 121.03,21.09 123.57,21.09 124.59,22.11 124.59,23.89 126.11,25.41 R9.1
M2XCF
  Top 0.254: C32.2 IC13.8 IC13.9 127.76,34.81 127.76,37.09 125.86,39 125.86,48.4 122.17,52.08 R23.1
M2XV
  Bottom 0.254: IC10.4 61.34,43.19 65.02,39.51 88.77,39.51 91.57,42.3 91.57,47.38 95.25,51.06 99.06,51.06 102.74,54.75 105.54,54.75 R72.1
M2YC  (via drill 0.3)
  Top 0.254: IC3.8 110.49,22.62 114.3,26.43 v114.3,46.75
  Bottom 0.254: v114.3,46.75 115.32,46.75 R22.1
M2YCF
  Top 0.254: C23.2 IC13.2 IC13.1
  Bottom 0.254: R15.1 102.62,52.08 107.82,46.87 113.16,46.87 C23.2
M2YV  (via drill 0.3)
  Top 0.254: v68.58,55.38 71.37,55.38 71.5,55.25 89.28,55.25 91.06,57.03 92.84,57.03 R70.1
  Bottom 0.254: IC9.15 50.55,48.27 51.69,47.13 55.12,47.13 57.66,49.67 61.21,49.67 66.93,55.38 v68.58,55.38
M3XC
  Top 0.254: IC4.6 129.92,11.44 133.73,15.25 R10.1
M3XCF
  Top 0.254: IC14.6 IC14.7 C36.2 138.18,20.33 131.95,26.55 125.09,26.55 122.56,29.09 116.71,29.09 115.06,30.74 115.06,48.02 121.67,54.62 R24.1
M3XV
  Top 0.254: IC10.14 66.42,45.73 72.64,51.95 75.44,51.95 80.26,47.13 90.55,47.13 94.36,50.94 104.52,50.94 109.22,55.64 R74.1
M3YC
  Bottom 0.254: IC4.8 124.46,11.82 130.94,18.3 130.94,20.2 136.4,25.66 136.4,36.08 R30.1
M3YCF  (via drill 0.3)
  Top 0.254: C33.2 IC14.2 IC14.1 | v127.38,50.17 128.91,50.17 v129.16,49.92
  Bottom 0.254: R19.1 113.67,50.17 v127.38,50.17 | v129.16,49.92 129.41,49.92 133.48,45.86 133.48,45.35 134.49,44.33 135,44.33 143.51,35.82 IC14.1
M3YV
  Top 0.254: IC9.14 48.26,46.11 50.42,48.27 50.42,50.05 57.4,57.03 65.15,57.03 68.45,53.73 82.55,53.73 85.34,50.94 89.28,50.94 91.44,53.1 R68.1
MCLR
  Bottom 0.254: IC1.1 34.29,11.44 DOA.3 28.07,17.79 29.84,19.57 29.84,21.85 36.83,28.84 R5.1
MIL_I
  Top 0.254: R88.3 R88.2 | IC15.1 TP1.TP 5.08,62.49 3.94,61.35 3.94,52.97 4.7,52.21 11.94,52.21 14.22,54.49 18.16,54.49 19.18,53.48 19.18,52.97 20.19,51.95 39.5,51.95 IC9.1 | IC10.3 58.42,46.11 57.98,46.55 | 57.98,46.55 56.64,47.89 56.64,49.03 IC10.1 | IC9.3 40.64,45.35 38.86,43.57 38.86,42.81 39.62,42.05 47.12,42.05 IC9.13 54.61,43.19 57.98,46.55
  Bottom 0.254: R88.2 8.89,64.78 IC15.1 | IC10.13 62.1,43.19 59.56,45.73 IC10.3 | IC9.1 40.89,50.81 44.58,54.49 44.58,56.27 45.34,57.03 46.1,57.03 46.86,56.27 46.86,51.95 IC9.3
MIL_N
  Top 0.254: IC10.12 60.2,40.65 | 60.2,40.65 IC10.5 53.09,40.65 52.7,41.03 48.64,41.03 IC9.12 IC9.5 40.26,40.65 38.42,42.49 | IC10.2 58.42,47.89 60.2,46.11 60.2,40.65 | TP2.TP R45.1 | TP2.TP IC15.7 | IC9.2 40.64,47.89 38.35,45.6 38.35,42.55 38.42,42.49 | 38.42,42.49 37.97,42.05 16.76,42.05 13.21,45.6 7.62,45.6 TP2.TP
MRB5
  Bottom 0.254: IC1.38 41.91,28.2 45.09,31.38 49.53,31.38 50.55,32.39 50.55,35.82 IC9.11
MRB6
  Bottom 0.254: IC1.39 39.62,26.68 44.83,31.89 49.28,31.89 50.04,32.65 50.04,33.79 IC9.10
MRB7
  Bottom 0.254: IC1.40 37.21,26.68 43.56,33.03 IC9.9
MRD4
  Top 0.254: IC10.11 66.04,37.73 69.85,33.92 IC1.27
MRD5
  Top 0.254: IC10.10 66.04,35.19 67.82,33.41 67.82,27.19 IC1.28
MRD6
  Top 0.254: IC1.29 64.77,31.76 IC10.9
N$1
  Top 0.254: IC1.20 86.36,11.44 OUT.1
N$2
  Top 0.254: IC1.19 82.93,11.44 88.01,6.36 OUT.2
N$3
  Top 0.254: C15.1 R13.1 99.06,48.27 R14.2
N$4
  Top 0.254: IC21.3 146.43,68.59 147.83,67.19 151.51,67.19 152.27,66.43 152.27,51.95 R32.2
N$5
  Top 0.254: C16.1 R13.2 IC12.3
N$6
  Top 0.254: R42.1 2.54,48.27 R45.2 IC15.6
N$7
  Top 0.254: C18.1 R12.1 99.06,25.41 R6.2
N$8
  Bottom 0.254: R33.2 139.7,50.56 137.29,52.97 137.29,59.45 140.21,62.37 142.37,62.37 IC21.14
N$9
  Top 0.254: C17.1 R12.2 IC12.5
N$10
  Top 0.254: R46.2 5.08,58.43 IC15.2 9.4,62.75 9.4,63.89 7.62,65.67 R102.2
N$11
  Top 0.254: C21.1 R16.2 IC12.10
N$12
  Bottom 0.254: IC19.11 105.66,60.97 114.3,52.33 R23.2
N$13
  Top 0.254: R16.1 C22.1 R7.2
N$14  (via drill 0.3)
  Top 0.254: R103.2 v10.16,63.51
  Bottom 0.254: IC15.5 7.62,53.73 5.84,55.51 5.84,56.27 6.86,57.29 8.64,57.29 10.16,58.81 v10.16,63.51
N$15
  Bottom 0.254: R89.1 16.51,64.78 R50.1
N$16
  Top 0.254: IC19.6 96.52,60.59 104.14,52.97 R19.2
N$17
  Top 0.254: R17.1 C19.1 R18.2
N$18
  Top 0.254: IC12.12 R17.2 C20.1
N$19
  Top 0.254: R103.1 R102.1 7.62,71.13 R44.1 R43.1
N$20
  Bottom 0.254: R40.2 77.72,52.08 71.5,58.3 69.98,58.3 68.96,57.29 64.39,57.29 60.71,60.97 IC17.11
N$21
  Bottom 0.254: R88.1 11.43,65.8 9.4,63.76 9.4,63.13 8.38,62.11 6.22,62.11 R46.1
N$22
  Top 0.254: K1.5 22.23,19.7 D1.A
  Bottom 0.254: IC1.3 41.53,11.44 39.75,9.66 33.4,9.66 28.96,14.11 26.67,14.11 24.13,16.65 D1.A
N$23
  Top 0.254: R47.1 R104.1 R105.1
  Bottom 0.254: R48.1 17.78,41.03 12.95,45.86 12.95,64.78 13.84,65.67 13.84,72.53 R104.1
N$24
  Bottom 0.254: R38.2 84.96,41.92 82.3,44.59 80.26,44.59 75.44,49.41 75.44,51.19 69.85,56.78 64.14,56.78 61.09,59.83 51.94,59.83 IC17.6
N$25
  Top 0.254: C33.1 R29.1 143.51,38.11 R30.2
N$26
  Top 0.254: C34.1 R29.2 IC14.3
N$27
  Top 0.254: C36.1 R28.1 143.51,15.25 R10.2
N$28
  Top 0.254: R34.2 140.08,52.08 148.59,60.59 IC21.11
N$29
  Top 0.254: C35.1 R28.2 IC14.5
N$30
  Top 0.254: R11.2 C42.1 R35.1
N$31
  Top 0.254: C41.1 R35.2 IC14.10
N$32
  Bottom 0.254: IC21.6 140.97,60.59 146.18,55.38 146.18,45.6 R31.2
N$33
  Top 0.254: R36.1 C39.1 R37.2
N$34
  Top 0.254: IC14.12 R36.2 C40.1
N$35
  Top 0.254: R104.2 12.7,63.89 15.24,61.35 IC15.13 17.78,58.43 R50.2
N$36
  Top 0.254: IC19.14 105.66,68.59 108.08,66.18 108.08,60.84 R24.2
N$37
  Top 0.254: C24.1 R21.2 IC13.3
N$38
  Top 0.254: C23.1 R21.1 121.92,48.27 R22.2
N$39
  Top 0.254: C26.1 R20.1 121.92,25.41 R8.2
N$40
  Bottom 0.254: R15.2 95.63,52.08 100.33,56.78 100.33,64.78 IC19.3
N$41
  Bottom 0.254: IC15.10 15.24,53.73 13.46,55.51 13.46,64.27 R105.2
N$42
  Top 0.254: C25.1 R20.2 IC13.5
N$43
  Top 0.254: R9.2 C32.1 R25.1
N$44
  Top 0.254: R41.2 87.25,52.08 84.71,54.62 68.33,54.62 62.1,60.84 62.1,66.43 59.94,68.59 IC17.14
N$45
  Top 0.254: C31.1 R25.2 IC13.10
N$46
  Top 0.254: R49.2 IC15.9 R51.1
N$48  (via drill 0.3)
  Top 0.254: v71.75,56.02 68.96,56.02 v62.87,62.11
  Bottom 0.254: R39.2 88.9,42.81 84.58,47.13 80.26,47.13 71.75,55.64 v71.75,56.02 | v62.87,62.11 57.28,62.11 IC17.3
N$49
  Top 0.254: IC21.10 148.59,58.81 151.13,61.35 R84.2 R85.2
N$50
  Top 0.254: C73.1 R85.1
N$51
  Top 0.254: R86.2 R87.2 IC21.15
N$52
  Top 0.254: C74.1 R87.1
N$53
  Top 0.254: R83.2 R82.2 138.43,61.35 140.97,58.81 IC21.7
N$54
  Top 0.254: C70.1 R83.1
N$55
  Top 0.254: R80.2 R81.2 IC21.2
N$56
  Top 0.254: C69.1 R81.1
N$57
  Top 0.254: IC20.13 R79.1 C67.1
  Bottom 0.254: IC21.4 139.95,66.05 134.87,71.13 C67.1
N$58
  Top 0.254: R1.1 15.88,15.63 14.99,16.52 USB.1
N$59
  Top 0.254: C65.1 R77.1 IC20.2
  Bottom 0.254: IC21.13 148.59,66.43 150.37,68.21 150.37,68.97 149.35,69.99 136.78,69.99 134.49,72.27 120.9,72.27 119.76,71.13 IC20.2
N$60
  Top 0.254: R1.2 30.23,3.82 31.37,4.96 38.23,4.96 R2.2
  Bottom 0.254: IC1.17 77.09,11.44 73.53,7.88 61.47,7.88 59.82,6.23 57.66,6.23 55.12,3.69 39.5,3.69 R2.2
N$61
  Top 0.254: IC1.14 69.85,7.63 | 69.85,7.63 Q1.1 | 69.85,7.63 C5.2
N$62
  Top 0.254: 116.84,60.97 IC20.6 124.08,56.27 132.72,56.27 134.24,54.75 141.99,54.75 142.75,55.51 142.75,57.29 148.59,63.13 IC21.12 | 116.84,60.97 C66.1 | 116.84,60.97 R76.1
N$63
  Top 0.254: C68.1 129.54,60.97 | 129.54,60.97 IC20.9 | 129.54,60.97 R78.1
  Bottom 0.254: IC21.5 139.95,63.51 137.41,60.97 C68.1
N$64
  Top 0.254: C66.2 R76.2 IC20.7
  Bottom 0.254: R99.1 127.38,83.83 115.44,71.89 115.44,69.73 113.16,67.45 113.16,59.57 C66.2
N$65
  Top 0.254: C65.2 R77.2 116.84,76.08 119.25,73.67 IC20.1
  Bottom 0.254: R100.1 134.75,83.83 126.49,75.58 121.28,75.58 IC20.1
N$66
  Top 0.254: IC20.8 R78.2 C68.2 133.22,59.57 133.22,64.91 137.03,68.72 137.03,77.61 138.05,78.62 138.56,78.62 143.51,83.58 R101.1
N$67
  Top 0.254: R98.1 116.84,83.83 IC20.14 R79.2 C67.2
N$68
  Top 0.254: IC19.10 104.14,58.81 106.68,61.35 R72.2 R73.2
N$69
  Top 0.254: C63.1 R73.1
N$70
  Top 0.254: R74.2 R75.2 IC19.15
N$71
  Top 0.254: C64.1 R75.1
N$72
  Top 0.254: R70.2 R71.2 93.98,68.21 96.52,70.75 IC19.2
N$73
  Top 0.254: C60.1 R71.1
N$74
  Top 0.254: R69.2 R68.2 IC19.7
N$75
  Top 0.254: C59.1 R69.1
N$76
  Top 0.254: IC18.13 R67.1 C57.1
  Bottom 0.254: IC19.4 95.5,66.05 90.42,71.13 C57.1
N$77
  Top 0.254: C58.1 83.82,60.97 | 83.82,60.97 IC18.9 | 83.82,60.97 R66.1
  Bottom 0.254: IC19.5 95.5,63.51 92.96,60.97 C58.1
N$78
  Top 0.254: IC18.2 71.12,71.13 | 71.12,71.13 C55.1 | 71.12,71.13 R65.1
  Bottom 0.254: IC19.13 104.14,66.43 101.6,68.97 101.6,75.96 100.2,77.35 100.2,82.81 98.17,84.85 88.52,84.85 74.8,71.13 IC18.2
N$79
  Top 0.254: 71.12,60.97 IC18.6 74.8,59.83 86.74,59.83 87.5,60.59 87.5,63.64 91.06,67.19 91.82,67.19 92.58,66.43 92.58,63.38 93.6,62.37 97.54,62.37 98.68,63.51 IC19.12 | 71.12,60.97 C56.1 | 71.12,60.97 R64.1
N$80
  Top 0.254: R66.2 IC18.8
  Bottom 0.254: R96.1 96.27,83.83 92.58,80.15 92.58,79.64 91.57,78.62 91.06,78.62 87.5,75.07 87.5,73.29 86.49,72.27 85.98,72.27 85.22,71.51 85.22,59.57 85.28,59.51 | C58.2 85.28,59.51 | R66.2 84.2,58.43 85.28,59.51
N$81
  Top 0.254: IC18.14 R67.2 83.82,76.08 84.33,76.08 86.36,74.05 C57.2 86.36,73.92 91.06,78.62 94.11,78.62 99.31,83.83 R97.1
N$82
  Top 0.254: C56.2 69.85,57.16 R64.2 72.39,58.43 IC18.7
  Bottom 0.254: R94.1 64.77,62.24 C56.2
N$83
  Top 0.254: IC18.1 72.39,73.67 R65.2
  Bottom 0.254: R95.1 69.85,76.21 70.48,75.58 | R65.2 70.48,75.58 | 70.48,75.58 C55.2
N$84
  Top 0.254: C4.2 60.96,6.36 Q1.2 67.31,8.9 IC1.13
N$85
  Top 0.254: K1.1 19.68,6.11 16.26,2.68 15.49,2.68 5.71,12.46 5.71,28.59 PWR.2
N$86
  Bottom 0.254: K1.7 19.3,24.78 11.05,33.03 PWR.3
N$88
  Top 0.254: R4.1 48.01,7.63 50.55,5.09 DIAG.K
N$96
  Top 0.254: C6.1 IC1.18
N$97
  Top 0.254: IC13.12 R26.2 C30.1
N$98
  Top 0.254: R26.1 C29.1 R27.2
N$103
  Top 0.254: R99.2 125.73,86.37 HEADING.1
N$104
  Top 0.254: R101.2 137.29,86.37 135.76,84.85 124.21,84.85 HEADING.3
N$105
  Top 0.254: R100.2 132.21,86.37 131.19,85.35 124.21,85.35 HEADING.2
N$107
  Top 0.254: R98.2 101.73,86.37 100.2,87.89 86.11,87.89 MY.1
N$110
  Top 0.254: R96.2 87.63,86.37 MY.3
N$111
  Top 0.254: R97.2 96.65,86.37 95.63,87.39 86.11,87.39 MY.2
N$113
  Top 0.254: R95.2 77.47,86.37 MX.3
N$119
  Top 0.254: R94.2 65.91,86.37 66.93,87.39 78.99,87.39 MX.2
N$120
  Top 0.254: IC17.10 58.42,58.81 60.96,61.35 R60.2 R61.2
N$121
  Top 0.254: R61.1 61.98,73.67 65.79,77.48 C53.1
N$122
  Top 0.254: R62.2 R63.2 IC17.15
N$123
  Top 0.254: R63.1 67.06,73.67 70.87,77.48 C54.1
N$124
  Top 0.254: R58.2 R59.2 48.26,68.21 50.8,70.75 IC17.2
N$125
  Top 0.254: R59.1 48.64,73.67 51.31,76.34 54.74,76.34 C50.1
N$126
  Top 0.254: R57.2 R56.2 IC17.7
N$127
  Top 0.254: R57.1 46.74,73.67 50.55,77.48 C49.1
N$130
  Top 0.254: C44.1 R53.1 IC16.2 29.08,72.27 51.82,72.27 58.04,66.05 IC17.13
N$131
  Top 0.254: R55.1 IC16.13
  Bottom 0.254: IC17.4 49.78,66.05 44.7,71.13 C47.1 R55.1
N$133
  Top 0.254: R93.2 60.83,86.37 62.36,87.89 78.99,87.89 MX.1
N$134
  Top 0.254: 25.4,60.97 IC16.6 29.08,59.83 45.34,59.83 47.88,57.29 51.82,57.29 58.04,63.51 IC17.12 | 25.4,60.97 C45.1 | 25.4,60.97 R52.1
N$135
  Top 0.254: C48.1 38.1,60.97 | 38.1,60.97 IC16.9 | 38.1,60.97 R54.1
  Bottom 0.254: IC17.5 49.78,63.51 47.24,60.97 C48.1
N$136
  Top 0.254: R52.2 IC16.7
  Bottom 0.254: R91.1 27.94,75.83 24.26,72.15 24.26,59.57 24.32,59.51 | R52.2 24.32,59.51 | C45.2 23.24,58.43 24.32,59.51
N$137
  Top 0.254: C44.2 R53.2 25.4,76.08 27.81,73.67 IC16.1
  Bottom 0.254: R93.1 44.32,83.83 43.18,84.97 32.77,84.97 28.45,80.66 28.45,74.18 IC16.1
N$138
  Top 0.254: IC16.8 R54.2 C48.2
  Bottom 0.254: R92.1 33.02,79 31.88,77.86 31.88,62.11 IC16.8
N$139
  Top 0.254: R90.1 22.86,83.58 32.77,73.67 IC16.14 R55.2 C47.2
N$140
  Bottom 0.254: R90.2 24,86.37 25.53,87.89 40.89,87.89 BEARING.3
N$144
  Top 0.254: R92.2 39.37,86.37 BEARING.1
N$147
  Top 0.254: R91.2 29.08,86.37 30.1,87.39 40.89,87.39 BEARING.2
SPI_CLK
  Top 0.254: IC1.34 52.07,26.3 64.14,14.23 90.55,14.23 99.19,5.6 99.82,5.6 99.89,5.53 | 99.89,5.53 IC2.3 103.38,2.04 104.52,2.04 108.08,5.6 113.41,5.6 115.19,3.82 IC3.3 | IC6.3 104.14,13.6 102.74,12.2 102.74,8.39 99.89,5.53
  Bottom 0.254: IC3.3 115.95,3.82 117.73,2.04 127.76,2.04 IC4.3 129.54,3.69 131.19,2.04 141.35,2.04 143.13,3.82 IC5.3 | IC7.3 122.81,15.25 121.03,17.03 120.27,17.03 119.25,16.01 119.25,14.23 118.49,13.47 105.92,13.47 IC6.3
SPI_DAT  (via drill 0.3)
  Top 0.254: IC1.26 72.77,26.68 84.71,14.74 91.06,14.74 v99.44,6.36 | IC6.4 106.68,6.36 106.62,6.3 | IC2.4 106.62,6.3 | IC3.4 117.73,3.82 116.01,5.53 | 116.01,5.53 115.32,6.23 106.68,6.23 106.62,6.3 | 116.01,5.53 124.27,13.79 | 124.27,13.79 IC7.4 | 124.27,13.79 125.6,12.46 125.6,10.68 132.08,4.2 IC4.4 133.86,2.04 143.89,2.04 145.67,3.82 IC5.4
  Bottom 0.254: v99.44,6.36 101.6,6.36 IC2.4
USB_DM
  Bottom 0.254: IC1.23 79.63,26.68 72.26,19.31 55.24,19.31 48.13,12.2 48.13,10.42 44.2,6.49 25.65,6.49 16,16.14 16,17.92 14.99,18.93 USB.2
USB_DP
  Bottom 0.254: IC1.24 77.09,26.68 70.23,19.82 50.67,19.82 43.05,12.2 43.05,10.42 41.78,9.15 29.84,9.15 27.43,11.57 24.38,11.57 21.46,14.49 21.46,15 16.26,20.2 14.1,20.2 12.95,19.06 USB.3
USBDOA
  Top 0.254: IC1.2 39.37,8.77 | 39.37,8.77 R3.1 | U/D.2 30.23,7.63 31.37,8.77 39.37,8.77

## Text on the board
tNames: BEARING | MILES | HEADING | BX | BY | BZ | M1X | M2X | M3X | M3Y | M2Y | M1Y | HX | HY | HZ | M | BH | X | X | Y | Y | Z | Z | GND | -5V | SHT | HSI | SHT | #1 | +5V | GND | CLK | RST | DAT | GND | A | B
bNames: 1 | 2 | 3